# Altium project IR_7arry.PrjPcb
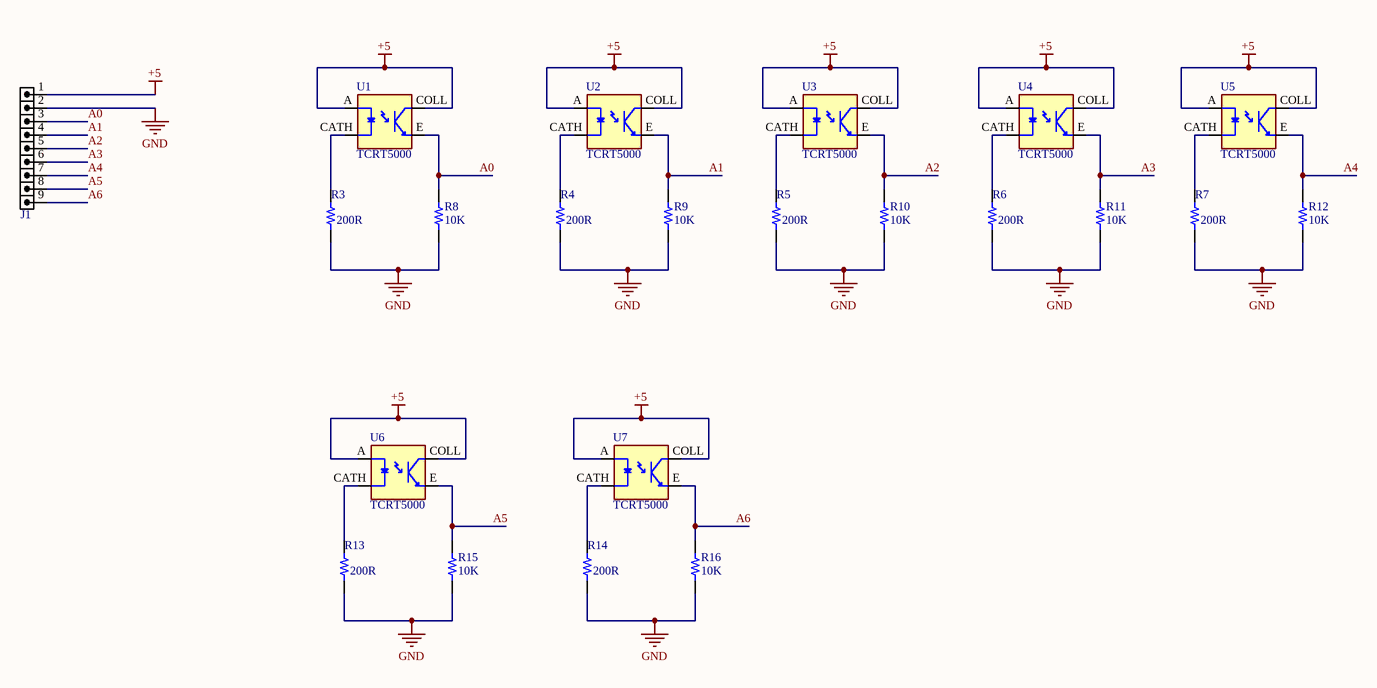
[diagram p0: IR_7arry.SchDoc]
1 sheet, 22 parts. Net scope: global (net labels, ports and power ports of the same name join across sheets).
Board file: IR_7arry.PcbDoc

## Sheet IR_7arry.SchDoc
size A3; SheetNumber: 1; SheetTotal: 1

### Parts
J1  HDR1X9  [HDRR_M_1X9]  (value not drawn)
R3  200R  [RES TH 1/8W AXIAL-0.25]
R4  200R  [RES TH 1/8W AXIAL-0.25]
R5  200R  [RES TH 1/8W AXIAL-0.25]
R6  200R  [RES TH 1/8W AXIAL-0.25]
R7  200R  [RES TH 1/8W AXIAL-0.25]
R8  10K  [RES TH 1/8W AXIAL-0.25]
R9  10K  [RES TH 1/8W AXIAL-0.25]
R10  10K  [RES TH 1/8W AXIAL-0.25]
R11  10K  [RES TH 1/8W AXIAL-0.25]
R12  10K  [RES TH 1/8W AXIAL-0.25]
R13  200R  [RES TH 1/8W AXIAL-0.25]
R14  200R  [RES TH 1/8W AXIAL-0.25]
R15  10K  [RES TH 1/8W AXIAL-0.25]
R16  10K  [RES TH 1/8W AXIAL-0.25]
U1  TCRT5000  [OPTO_TCRT5000]
U2  TCRT5000  [OPTO_TCRT5000]
U3  TCRT5000  [OPTO_TCRT5000]
U4  TCRT5000  [OPTO_TCRT5000]
U5  TCRT5000  [OPTO_TCRT5000]
U6  TCRT5000  [OPTO_TCRT5000]
U7  TCRT5000  [OPTO_TCRT5000]

### Nets
+5: J1.1 U1.A U1.COLL U2.A U2.COLL U3.A U3.COLL U4.A U4.COLL U5.A U5.COLL U6.A U6.COLL U7.A U7.COLL
GND: J1.2 R3.1 R4.1 R5.1 R6.1 R7.1 R8.1 R9.1 R10.1 R11.1 R12.1 R13.1 R14.1 R15.1 R16.1
A0: J1.3 R8.2 U1.E
A1: J1.4 R9.2 U2.E
A2: J1.5 R10.2 U3.E
A3: J1.6 R11.2 U4.E
A4: J1.7 R12.2 U5.E
A5: J1.8 R15.2 U6.E
A6: J1.9 R16.2 U7.E
NetR3_2: R3.2 U1.CATH
NetR4_2: R4.2 U2.CATH
NetR5_2: R5.2 U3.CATH
NetR6_2: R6.2 U4.CATH
NetR7_2: R7.2 U5.CATH
NetR13_2: R13.2 U6.CATH
NetR14_2: R14.2 U7.CATH

### Library data of the parts
J1 = HDRR_M_1X9: CONN, HEADER, RightAngle, Male, pitch: 2.54mm, 9POS; VALUE: HDRM9
R3-R16 = Res TH 1/8W AXIAL-0.25: TH Resistor; VALUE: 1K
U1-U7 = TCRT5000: 950 nm 60 mA Through Hole Reflective Optical Sensor with Transistor Output; Availability: Unavailable; MP: TCRT5000; Value: *; Price: None; Package: None